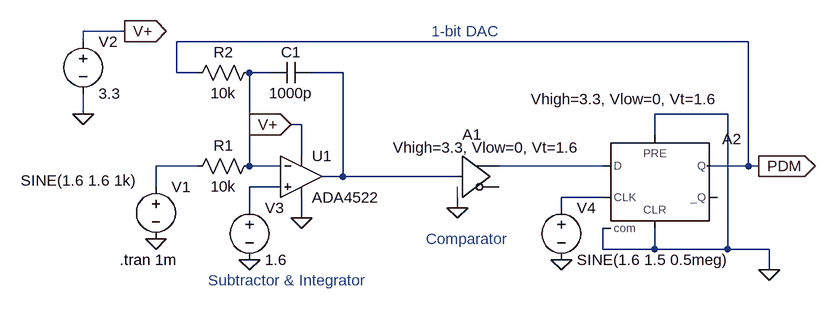
[diagram p0: schematic dsm_step3.asc]
dsm_step3.asc, the LTspice schematic file:
Version 4
SHEET 1 1752 680
WIRE 608 -112 544 -112
WIRE 544 -96 544 -112
WIRE 1568 -96 688 -96
WIRE 688 -48 688 -96
WIRE 720 -48 688 -48
WIRE 832 -48 800 -48
WIRE 944 -48 896 -48
WIRE 544 16 544 -16
WIRE 1536 16 1424 16
WIRE 880 32 864 32
WIRE 1424 48 1424 16
WIRE 880 80 880 32
WIRE 720 96 656 96
WIRE 800 96 800 -48
WIRE 848 96 800 96
WIRE 1344 96 1184 96
WIRE 1568 96 1568 -96
WIRE 1568 96 1504 96
WIRE 1584 96 1568 96
WIRE 944 112 944 -48
WIRE 944 112 912 112
WIRE 1120 112 944 112
WIRE 656 128 656 96
WIRE 848 128 800 128
WIRE 1344 144 1280 144
WIRE 800 160 800 128
WIRE 1120 160 1120 144
WIRE 1280 160 1280 144
WIRE 880 176 880 144
WIRE 1344 224 1344 192
WIRE 1424 224 1424 192
WIRE 1424 224 1344 224
WIRE 1536 224 1536 16
WIRE 1536 224 1424 224
WIRE 1600 224 1536 224
WIRE 1600 256 1600 224
FLAG 656 208 0
FLAG 864 32 V+
IOPIN 864 32 In
FLAG 544 16 0
FLAG 608 -112 V+
IOPIN 608 -112 Out
FLAG 1120 160 0
FLAG 1280 240 0
FLAG 1600 256 0
FLAG 1584 96 PDM
IOPIN 1584 96 Out
FLAG 800 240 0
FLAG 880 176 0
SYMBOL voltage 656 112 R0
WINDOW 3 -208 6 Left 2
WINDOW 123 0 0 Left 0
WINDOW 39 0 0 Left 0
SYMATTR Value SINE(1.6 1.6 1k)
SYMATTR InstName V1
SYMBOL OpAmps\\ADA4522 880 48 R0
SYMATTR InstName U1
SYMBOL res 816 80 R90
WINDOW 0 0 56 VBottom 2
WINDOW 3 32 56 VTop 2
SYMATTR InstName R1
SYMATTR Value 10k
SYMBOL res 816 -64 R90
WINDOW 0 0 56 VBottom 2
WINDOW 3 32 56 VTop 2
SYMATTR InstName R2
SYMATTR Value 10k
SYMBOL cap 896 -64 R90
WINDOW 0 0 32 VBottom 2
WINDOW 3 32 32 VTop 2
SYMATTR InstName C1
SYMATTR Value 1000p
SYMBOL voltage 544 -112 R0
WINDOW 123 0 0 Left 0
WINDOW 39 0 0 Left 0
SYMATTR InstName V2
SYMATTR Value 3.3
SYMBOL Digital\\buf 1120 48 R0
WINDOW 0 8 -1 Left 2
WINDOW 3 -99 19 Left 2
SYMATTR InstName A1
SYMATTR Value Vhigh=3.3, Vlow=0, Vt=1.6
SYMBOL Digital\\dflop 1424 48 R0
WINDOW 3 -191 -55 Left 2
SYMATTR Value Vhigh=3.3, Vlow=0, Vt=1.6
SYMATTR InstName A2
SYMBOL voltage 1280 144 R0
WINDOW 123 0 0 Left 0
WINDOW 39 0 0 Left 0
SYMATTR InstName V4
SYMATTR Value SINE(1.6 1.5 0.5meg)
SYMBOL voltage 800 144 R0
WINDOW 123 0 0 Left 0
WINDOW 39 0 0 Left 0
SYMATTR InstName V3
SYMATTR Value 1.6
TEXT 736 272 Left 2 ;Subtractor & Integrator
TEXT 1072 208 Left 2 ;Comparator
TEXT 600 240 Left 2 !.tran 1m
TEXT 1080 -112 Left 2 ;1-bit DAC

The netlist it stands for:
* dsm_step3.asc
V1 N003 0 SINE(1.6 1.6 1k)
XU1 N005 N001 V+ 0 N002 ADA4522  ; pins In+ In- V+ V- OUT
R1 N001 N003 10k
R2 N001 PDM 10k
C1 N002 N001 1000p
V2 V+ 0 3.3
A1 N002 0 0 0 0 0 N004 0 BUF Vhigh=3.3, Vlow=0, Vt=1.6
A2 N004 0 N006 0 0 0 PDM 0 DFLOP Vhigh=3.3, Vlow=0, Vt=1.6
V4 N006 0 SINE(1.6 1.5 0.5meg)
V3 N005 0 1.6
* Subtractor & Integrator
* Comparator
.tran 1m
* 1-bit DAC
.backanno
.end